# Altium project TP_IHM.PrjPCB
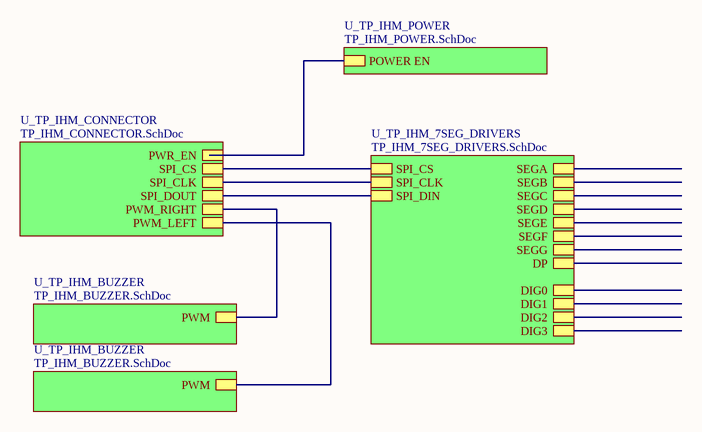
[diagram p0: TP_IHM_MAIN.SchDoc]
6 sheets, 52 parts. Net scope: hierarchical (ports join the sheet entries above them; power ports are global).
Sheets:
  TP_IHM_MAIN.SchDoc
    U_TP_IHM_CONNECTOR = TP_IHM_CONNECTOR.SchDoc
    U_TP_IHM_BUZZER = TP_IHM_BUZZER.SchDoc
    U_TP_IHM_POWER = TP_IHM_POWER.SchDoc
    U_TP_IHM_BUZZER = TP_IHM_BUZZER.SchDoc
    U_TP_IHM_7SEG_DRIVERS = TP_IHM_7SEG_DRIVERS.SchDoc
  TP_IHM_7SEG.SchDoc

## Sheet TP_IHM_MAIN.SchDoc
size A4

### Sub-sheets
U_TP_IHM_7SEG_DRIVERS = TP_IHM_7SEG_DRIVERS.SchDoc: SPI_CS, SPI_CLK, SPI_DIN, SEGA, SEGB, SEGC, SEGD, SEGE, SEGF, SEGG, DP, DIG0, DIG1, DIG2, DIG3
U_TP_IHM_BUZZER = TP_IHM_BUZZER.SchDoc: PWM
U_TP_IHM_BUZZER = TP_IHM_BUZZER.SchDoc: PWM
U_TP_IHM_CONNECTOR = TP_IHM_CONNECTOR.SchDoc: PWR_EN, SPI_CLK, SPI_DOUT, PWM_RIGHT, SPI_CS, PWM_LEFT
U_TP_IHM_POWER = TP_IHM_POWER.SchDoc: POWER EN

### Nets
NetIC?#4_4: sheet U_TP_IHM_CONNECTOR/PWR_EN, sheet U_TP_IHM_POWER/POWER EN
NetIC?#5_1: sheet U_TP_IHM_CONNECTOR/SPI_DOUT, sheet U_TP_IHM_7SEG_DRIVERS/SPI_DIN
NetIC?#5_12: sheet U_TP_IHM_CONNECTOR/SPI_CS, sheet U_TP_IHM_7SEG_DRIVERS/SPI_CS
NetIC?#5_13: sheet U_TP_IHM_CONNECTOR/SPI_CLK, sheet U_TP_IHM_7SEG_DRIVERS/SPI_CLK
NetM?_U_TP_IHM_BUZZER#1_G: sheet U_TP_IHM_CONNECTOR/PWM_RIGHT, sheet U_TP_IHM_BUZZER/PWM
NetM?_U_TP_IHM_BUZZER#2_G: sheet U_TP_IHM_CONNECTOR/PWM_LEFT, sheet U_TP_IHM_BUZZER/PWM

## Sheet TP_IHM_CONNECTOR.SchDoc
size A4
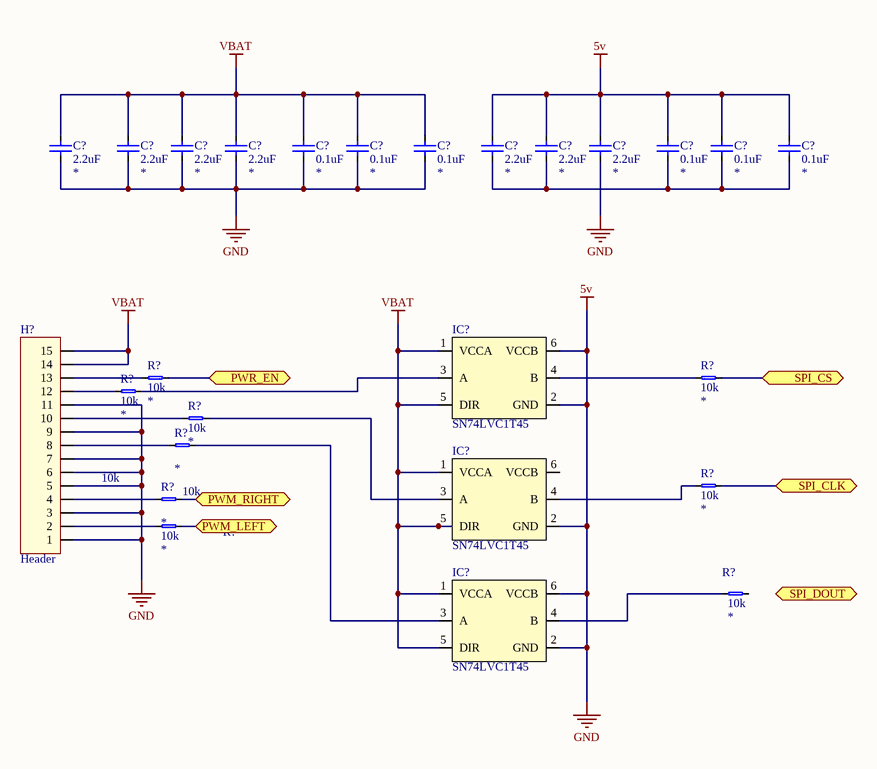
[diagram p1: TP_IHM_CONNECTOR.SchDoc]

### Parts
(Parts that share a designator on the sheet are numbered #1, #2 ... from top to bottom, then left to right.)
C?#1  value 2.2uF  [0603_CAP_LD]  (hidden comment: CerCap)
C?#2  value 2.2uF  [0603_CAP_LD]  (hidden comment: CerCap)
C?#3  value 2.2uF  [0603_CAP_LD]  (hidden comment: CerCap)
C?#4  value 2.2uF  [0603_CAP_LD]  (hidden comment: CerCap)
C?#5  value 0.1uF  [0603_CAP_LD]  (hidden comment: CerCap)
C?#6  value 0.1uF  [0603_CAP_LD]  (hidden comment: CerCap)
C?#7  value 0.1uF  [0603_CAP_LD]  (hidden comment: CerCap)
C?#8  value 2.2uF  [0603_CAP_LD]  (hidden comment: CerCap)
C?#9  value 2.2uF  [0603_CAP_LD]  (hidden comment: CerCap)
C?#10  value 2.2uF  [0603_CAP_LD]  (hidden comment: CerCap)
C?#11  value 0.1uF  [0603_CAP_LD]  (hidden comment: CerCap)
C?#12  value 0.1uF  [0603_CAP_LD]  (hidden comment: CerCap)
C?#13  value 0.1uF  [0603_CAP_LD]  (hidden comment: CerCap)
H?  Header  [653115131822]
IC?#1  SN74LVC1T45  [MO-203AB_LD]
IC?#2  SN74LVC1T45  [MO-203AB_LD]
IC?#3  SN74LVC1T45  [MO-203AB_LD]
R?#1  value 10k  [0603_RES_LD]  (hidden comment: Resistor)
R?#2  value 10k  [0603_RES_LD]  (hidden comment: Resistor)
R?#3  value 10k  [0603_RES_LD]  (hidden comment: Resistor)
R?#4  value 10k  [0603_RES_LD]  (hidden comment: Resistor)
R?#5  value 10k  [0603_RES_LD]  (hidden comment: Resistor)
R?#6  value 10k  [0603_RES_LD]  (hidden comment: Resistor)
R?#7  value 10k  [0603_RES_LD]  (hidden comment: Resistor)
R?#8  value 10k  [0603_RES_LD]  (hidden comment: Resistor)
R?#9  value 10k  [0603_RES_LD]  (hidden comment: Resistor)

### Ports
PWM_LEFT, PWM_RIGHT, PWR_EN, SPI_CLK, SPI_CS, SPI_DOUT

### Nets
5v: C?#1.1 C?#2.1 C?#3.1 C?#4.1 C?#5.1 C?#6.1 C?#7.1 C?#8.2 C?#9.2 C?#10.1 C?#10.2 C?#11.2 C?#12.2 C?#13.2 H?.1 H?.3 H?.5 H?.6 H?.7 H?.9 H?.11 IC?#1.2(GND) IC?#1.6(VCCB) IC?#2.2(GND) IC?#3.2(GND) IC?#3.6(VCCB)  [also labelled GND]
VBAT: C?#1.2 C?#2.2 C?#3.2 C?#4.2 C?#5.2 C?#6.2 C?#7.2 H?.14 H?.15 IC?#1.1(VCCA) IC?#1.5(DIR) IC?#2.1(VCCA) IC?#2.5(DIR) IC?#3.1(VCCA) IC?#3.5(DIR)
NetC?#8_1: C?#8.1 C?#9.1 C?#11.1 C?#12.1 C?#13.1
NetH?_2: H?.2 R?#8.1
NetH?_4: H?.4 R?#7.1
NetH?_8: H?.8 R?#5.1
NetH?_10: H?.10 R?#4.1
NetH?_12: H?.12 R?#3.1
NetH?_13: H?.13 R?#1.1
NetIC?#1_3: IC?#1.3(A) R?#3.2
NetIC?#1_4: IC?#1.4(B) R?#2.1
NetIC?#2_3: IC?#2.3(A) R?#4.2
NetIC?#2_4: IC?#2.4(B) R?#6.1
NetIC?#3_3: IC?#3.3(A) R?#5.2
NetIC?#3_4: IC?#3.4(B) R?#9.1
NetIC?#4_4: R?#1.2 ; port PWR_EN
NetIC?#5_12: R?#2.2 ; port SPI_CS
NetIC?#5_13: R?#6.2 ; port SPI_CLK
NetM?_U_TP_IHM_BUZZER#1_G: R?#7.2 ; port PWM_RIGHT
NetM?_U_TP_IHM_BUZZER#2_G: R?#8.2 ; port PWM_LEFT

Not connected (* = marked no-connect by the designer): IC?#2 6(VCCB); R?#9 2

### Library data of the parts
C?#1-C?#13 = CerCap: Ceramic Capacitor; Type: *; Voltage/Power: *; Package: *
H? = HEADER_15x1: Header 15x1
IC?#1-IC?#3 = SN74LVC1T45: Single Bit Dual Supply Buffer
R?#1-R?#9 = Resistor: Precision: *; Package: *

## Sheet TP_IHM_BUZZER.SchDoc
size A4
Used 2 times, as channels U_TP_IHM_BUZZER, U_TP_IHM_BUZZER. Parts and nets are listed once, with the designators drawn on the sheet.
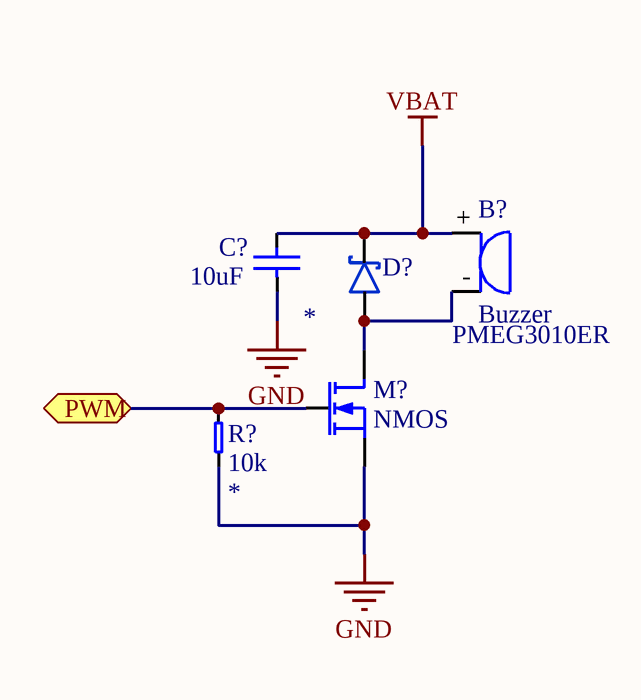
[diagram p2: TP_IHM_BUZZER.SchDoc]

### Parts
B?  Buzzer  [SD160709]
C?  value 10uF  [0603_CAP_LD]  (hidden comment: CerCap)
D?  PMEG3010ER  [SOD123W]
M?  NMOS  [MOSFET-SOT23]
R?  value 10k  [0603_RES_LD]  (hidden comment: Resistor)

### Ports
PWM

### Nets
GND: C?.1 M?.S R?.1
VBAT: B?.+ C?.2 D?.K
PWM: M?.G R?.2 ; port PWM
NetB?_-: B?.- D?.A M?.D

### Channels
U_TP_IHM_BUZZER: designators end in _U_TP_IHM_BUZZER#1; ports PWM=NetM?_U_TP_IHM_BUZZER#1_G
U_TP_IHM_BUZZER: designators end in _U_TP_IHM_BUZZER#2; ports PWM=NetM?_U_TP_IHM_BUZZER#2_G

### Library data of the parts
B? = SD160709: TDK SD160709 Buzzer; Reference: SD160709
C? = CerCap: Ceramic Capacitor; Type: *; Voltage/Power: *; Package: *
D? = Schottky_PMEG3010ER: Nexperia 1A low Vf Mega Schottky barrier rectifier; Reference: PMEG3010ER
M? = N-MOSFET: N MOSFET
R? = Resistor: Precision: *; Package: *

## Sheet TP_IHM_POWER.SchDoc
size A4
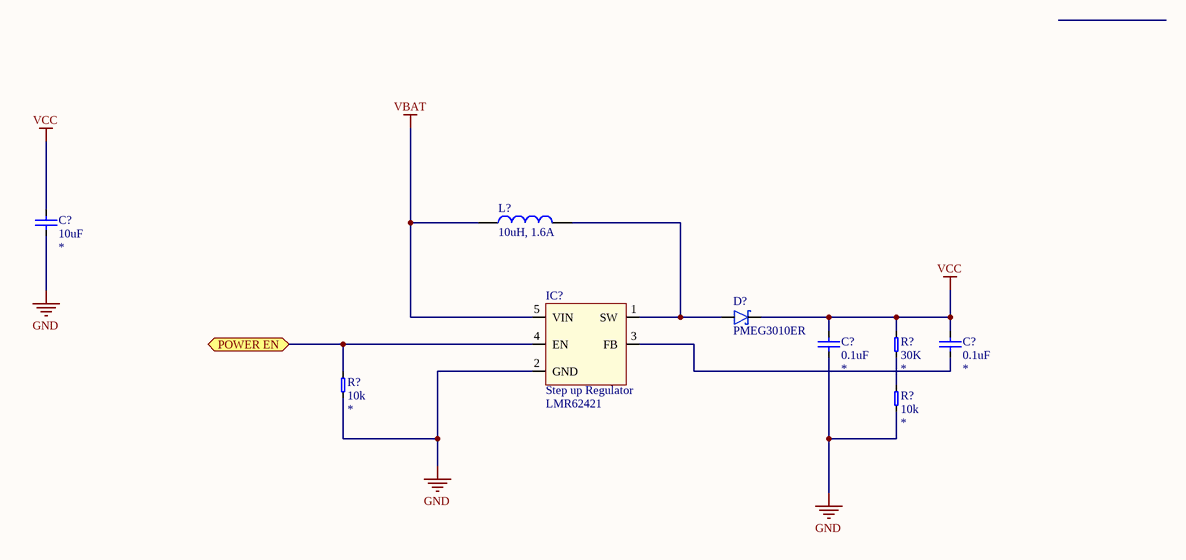
[diagram p3: TP_IHM_POWER.SchDoc]

### Parts
(Parts that share a designator on the sheet are numbered #1, #2 ... from top to bottom, then left to right.)
C?#14  value 10uF  [0603_CAP_LD]  (hidden comment: CerCap)
C?#15  value 0.1uF  [0603_CAP_LD]  (hidden comment: CerCap)
C?#16  value 0.1uF  [0603_CAP_LD]  (hidden comment: CerCap)
D?  PMEG3010ER  [SOD123W]
IC?#4  Step up Regulator  [LMR62421]
L?  10uH, 1.6A  [INDUCTOR_WE-LQS_5020]
R?#10  value 30K  [0603_RES_LD]  (hidden comment: Resistor)
R?#11  value 10k  [0603_RES_LD]  (hidden comment: Resistor)
R?#12  value 10k  [0603_RES_LD]  (hidden comment: Resistor)

### Ports
POWER EN

### Nets
GND: C?#14.1 C?#15.1 IC?#4.2(GND) R?#11.1 R?#12.1  [project net 5v]
VBAT: IC?#4.5(VIN) L?.1
VCC: C?#14.2 C?#15.2 C?#16.2 D?.K R?#10.2
NetC?#16_1: C?#16.1 IC?#4.3(FB)
NetD?_A: D?.A IC?#4.1(SW) L?.2
NetIC?#4_4: IC?#4.4(EN) R?#11.2 ; port POWER EN
NetR?#10_1: R?#10.1 R?#12.2

### Library data of the parts
C?#14-C?#16 = CerCap: Ceramic Capacitor; Type: *; Voltage/Power: *; Package: *
D? = Schottky_PMEG3010ER: as D? on sheet TP_IHM_BUZZER; Reference: PMEG3010ER
IC?#4 = LMR62421XMF: LMR62421 simple switcher 24 Vout stepup voltage SOT-23; Reference: LMR62421
L? = INDUCTOR_74404052100: WE-LQS SMD Power Inductor, size 5020, 10uH, 1.6A; DC Resistance: 109mOhm; Inductance Tolerance: +/-20%; Saturation Current: 1.95A; Self Resonant Frequency: 37MHz; ComponentLink1Description: Manufacturer; ComponentLink1URL: http://www.we-online.de; ComponentLink2Description: Datasheet; ComponentLink2URL: https://katalog.we-online.com/pbs/datasheet/74404052100.pdf; Part Number: 74404052100; Published Date: May 2019; Publisher: Wurth Elektronik; Rated Current: 1.6A; Inductance: 10uH; Operating Temperature: -40 to +125degC; Mounting Technology: SMT; Packaging: Tape and Reel; DC Resistance Tolerance: +/-20%; Size: 5020; Reference: 74404052100
R?#10-R?#12 = Resistor: Precision: *; Package: *

## Sheet TP_IHM_7SEG_DRIVERS.SchDoc
size A4
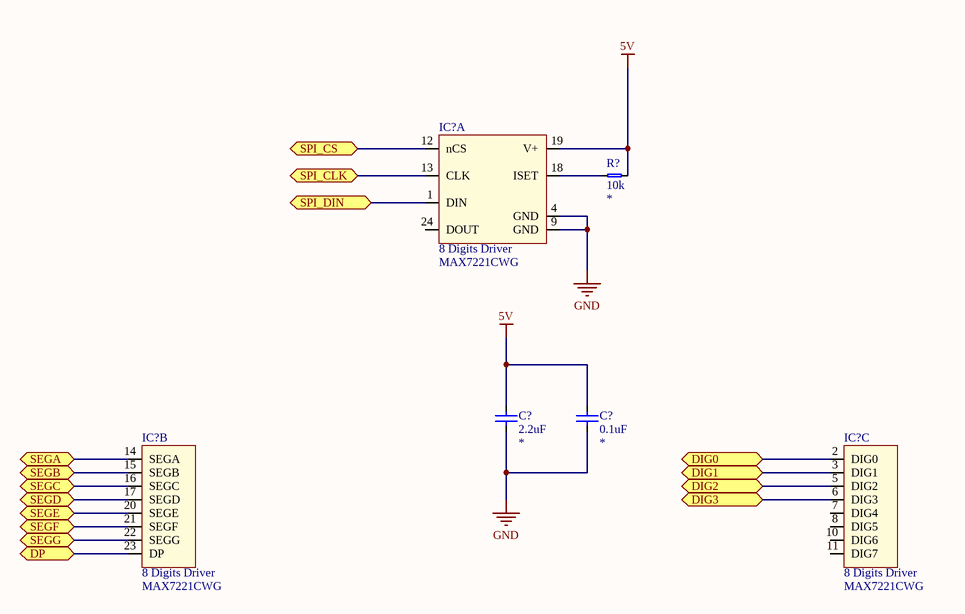
[diagram p4: TP_IHM_7SEG_DRIVERS.SchDoc]

### Parts
(Parts that share a designator on the sheet are numbered #1, #2 ... from top to bottom, then left to right.)
C?#17  value 2.2uF  [0603_CAP_LD]  (hidden comment: CerCap)
C?#18  value 0.1uF  [0603_CAP_LD]  (hidden comment: CerCap)
IC?#5  8 Digits Driver  [MAX7221CWG]  (part A of 3)
IC?#6  8 Digits Driver  [MAX7221CWG]  (part B of 3)
IC?#7  8 Digits Driver  [MAX7221CWG]  (part C of 3)
R?#13  value 10k  [0603_RES_LD]  (hidden comment: Resistor)

### Ports
DIG0, DIG1, DIG2, DIG3, DP, SEGA, SEGB, SEGC, SEGD, SEGE, SEGF, SEGG, SPI_CLK, SPI_CS, SPI_DIN

### Nets
5v: C?#17.1 C?#17.2 C?#18.1 C?#18.2 IC?#5.4(GND) IC?#5.9(GND) IC?#5.19(V+) R?#13.2  [also labelled GND]
NetIC?#5_1: IC?#5.1(DIN) ; port SPI_DIN
NetIC?#5_12: IC?#5.12(nCS) ; port SPI_CS
NetIC?#5_13: IC?#5.13(CLK) ; port SPI_CLK
NetIC?#5_18: IC?#5.18(ISET) R?#13.1
NetIC?#6_14: IC?#6.14(SEGA) ; port SEGA
NetIC?#6_15: IC?#6.15(SEGB) ; port SEGB
NetIC?#6_16: IC?#6.16(SEGC) ; port SEGC
NetIC?#6_17: IC?#6.17(SEGD) ; port SEGD
NetIC?#6_20: IC?#6.20(SEGE) ; port SEGE
NetIC?#6_21: IC?#6.21(SEGF) ; port SEGF
NetIC?#6_22: IC?#6.22(SEGG) ; port SEGG
NetIC?#6_23: IC?#6.23(DP) ; port DP
NetIC?#7_2: IC?#7.2(DIG0) ; port DIG0
NetIC?#7_3: IC?#7.3(DIG1) ; port DIG1
NetIC?#7_5: IC?#7.5(DIG2) ; port DIG2
NetIC?#7_6: IC?#7.6(DIG3) ; port DIG3

Not connected (* = marked no-connect by the designer): IC?#5 24(DOUT); IC?#7 7(DIG4) 8(DIG5) 10(DIG6) 11(DIG7)

### Library data of the parts
C?#17 C?#18 = CerCap: Ceramic Capacitor; Type: *; Voltage/Power: *; Package: *
IC?#5-IC?#7 = MAX7221: MAX7221 8 Digit 7 Segments Display; Reference: MAX7221CWG
R?#13 = Resistor: Precision: *; Package: *

## Sheet TP_IHM_7SEG.SchDoc
size A4
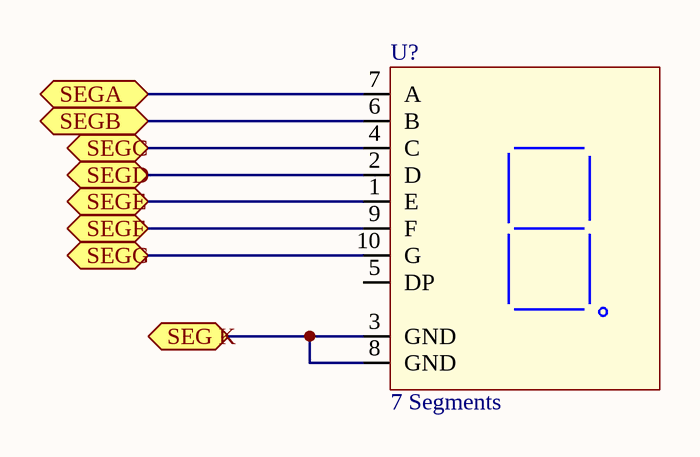
[diagram p5: TP_IHM_7SEG.SchDoc]

### Parts
U?  7 Segments  [SA10-21GWA]

### Ports
SEG K, SEGA, SEGB, SEGC, SEGD, SEGE, SEGF, SEGG

### Nets
NetU?_1: U?.1(E) ; port SEGE
NetU?_2: U?.2(D) ; port SEGD
NetU?_3: U?.3(GND) U?.8(GND) ; port SEG K
NetU?_4: U?.4(C) ; port SEGC
NetU?_6: U?.6(B) ; port SEGB
NetU?_7: U?.7(A) ; port SEGA
NetU?_9: U?.9(F) ; port SEGF
NetU?_10: U?.10(G) ; port SEGG

Not connected (* = marked no-connect by the designer): U? 5(DP)

### Library data of the parts
U? = SC10-21SRWA: KingBright Led 7 Segments; Reference: SC10-21SRWA

## Nets that join several sheets
5v: TP_IHM_CONNECTOR (26 pins), U_TP_IHM_BUZZER (C?_U_TP_IHM_BUZZER#1.1 M?_U_TP_IHM_BUZZER#1.S R?_U_TP_IHM_BUZZER#1.1), TP_IHM_POWER (5 pins), U_TP_IHM_BUZZER (C?_U_TP_IHM_BUZZER#2.1 M?_U_TP_IHM_BUZZER#2.S R?_U_TP_IHM_BUZZER#2.1), TP_IHM_7SEG_DRIVERS (8 pins)
VBAT: TP_IHM_CONNECTOR (15 pins), U_TP_IHM_BUZZER (B?_U_TP_IHM_BUZZER#1.+ C?_U_TP_IHM_BUZZER#1.2 D?_U_TP_IHM_BUZZER#1.K), TP_IHM_POWER (IC?#4.5 L?.1), U_TP_IHM_BUZZER (B?_U_TP_IHM_BUZZER#2.+ C?_U_TP_IHM_BUZZER#2.2 D?_U_TP_IHM_BUZZER#2.K)
NetIC?#4_4: TP_IHM_CONNECTOR (R?#1.2), TP_IHM_POWER (IC?#4.4 R?#11.2)
NetIC?#5_12: TP_IHM_CONNECTOR (R?#2.2), TP_IHM_7SEG_DRIVERS (IC?#5.12)
NetIC?#5_13: TP_IHM_CONNECTOR (R?#6.2), TP_IHM_7SEG_DRIVERS (IC?#5.13)
NetM?_U_TP_IHM_BUZZER#1_G: TP_IHM_CONNECTOR (R?#7.2), U_TP_IHM_BUZZER (M?_U_TP_IHM_BUZZER#1.G R?_U_TP_IHM_BUZZER#1.2)
NetM?_U_TP_IHM_BUZZER#2_G: TP_IHM_CONNECTOR (R?#8.2), U_TP_IHM_BUZZER (M?_U_TP_IHM_BUZZER#2.G R?_U_TP_IHM_BUZZER#2.2)